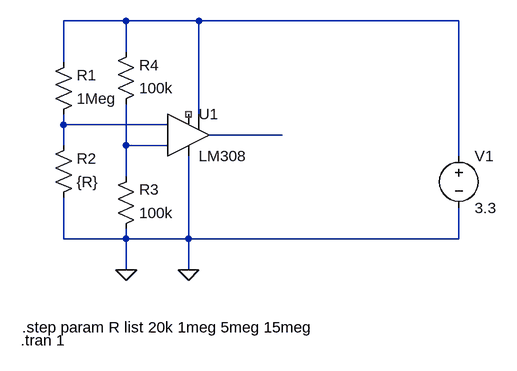
[diagram p0: schematic opamp.asc]
opamp.asc, the LTspice schematic file:
Version 4
SHEET 1 880 680
WIRE 96 -32 0 -32
WIRE 208 -32 96 -32
WIRE 608 -32 208 -32
WIRE 96 16 96 -32
WIRE 0 32 0 -32
WIRE 208 112 208 -32
WIRE 0 128 0 112
WIRE 160 128 0 128
WIRE 336 144 224 144
WIRE 0 160 0 128
WIRE 96 160 96 96
WIRE 160 160 96 160
WIRE 608 176 608 -32
WIRE 96 208 96 160
WIRE 0 304 0 240
WIRE 96 304 96 288
WIRE 96 304 0 304
WIRE 192 304 192 176
WIRE 192 304 96 304
WIRE 608 304 608 256
WIRE 608 304 192 304
WIRE 96 352 96 304
WIRE 192 352 192 304
FLAG 96 352 0
FLAG 192 352 0
SYMBOL Opamps\\LM308 192 80 R0
SYMATTR InstName U1
SYMBOL res -16 128 M180
WINDOW 0 36 76 Left 2
WINDOW 3 36 40 Left 2
SYMATTR InstName R1
SYMATTR Value 1Meg
SYMBOL res -16 256 M180
WINDOW 0 36 76 Left 2
WINDOW 3 36 40 Left 2
SYMATTR InstName R2
SYMATTR Value {R}
SYMBOL res 80 304 M180
WINDOW 0 36 76 Left 2
WINDOW 3 36 40 Left 2
SYMATTR InstName R3
SYMATTR Value 100k
SYMBOL res 80 112 M180
WINDOW 0 36 76 Left 2
WINDOW 3 36 40 Left 2
SYMATTR InstName R4
SYMATTR Value 100k
SYMBOL voltage 608 160 R0
WINDOW 123 0 0 Left 0
WINDOW 39 0 0 Left 0
SYMATTR InstName V1
SYMATTR Value 3.3
TEXT -64 440 Left 2 !.step param R list 20k 1meg 5meg 15meg
TEXT -66 460 Left 2 !.tran 1

The netlist it stands for:
* opamp.asc
XU1 N004 N002 N001 0 N003 NC_01 NC_02 LT1008
R1 N002 N001 1Meg
R2 0 N002 {R}
R3 0 N004 100k
R4 N004 N001 100k
V1 N001 0 3.3
.step param R list 20k 1meg 5meg 15meg
.tran 1
.lib LTC.lib
.backanno
.end